# Altium schematic sheet Sheet1.SchDoc
size A
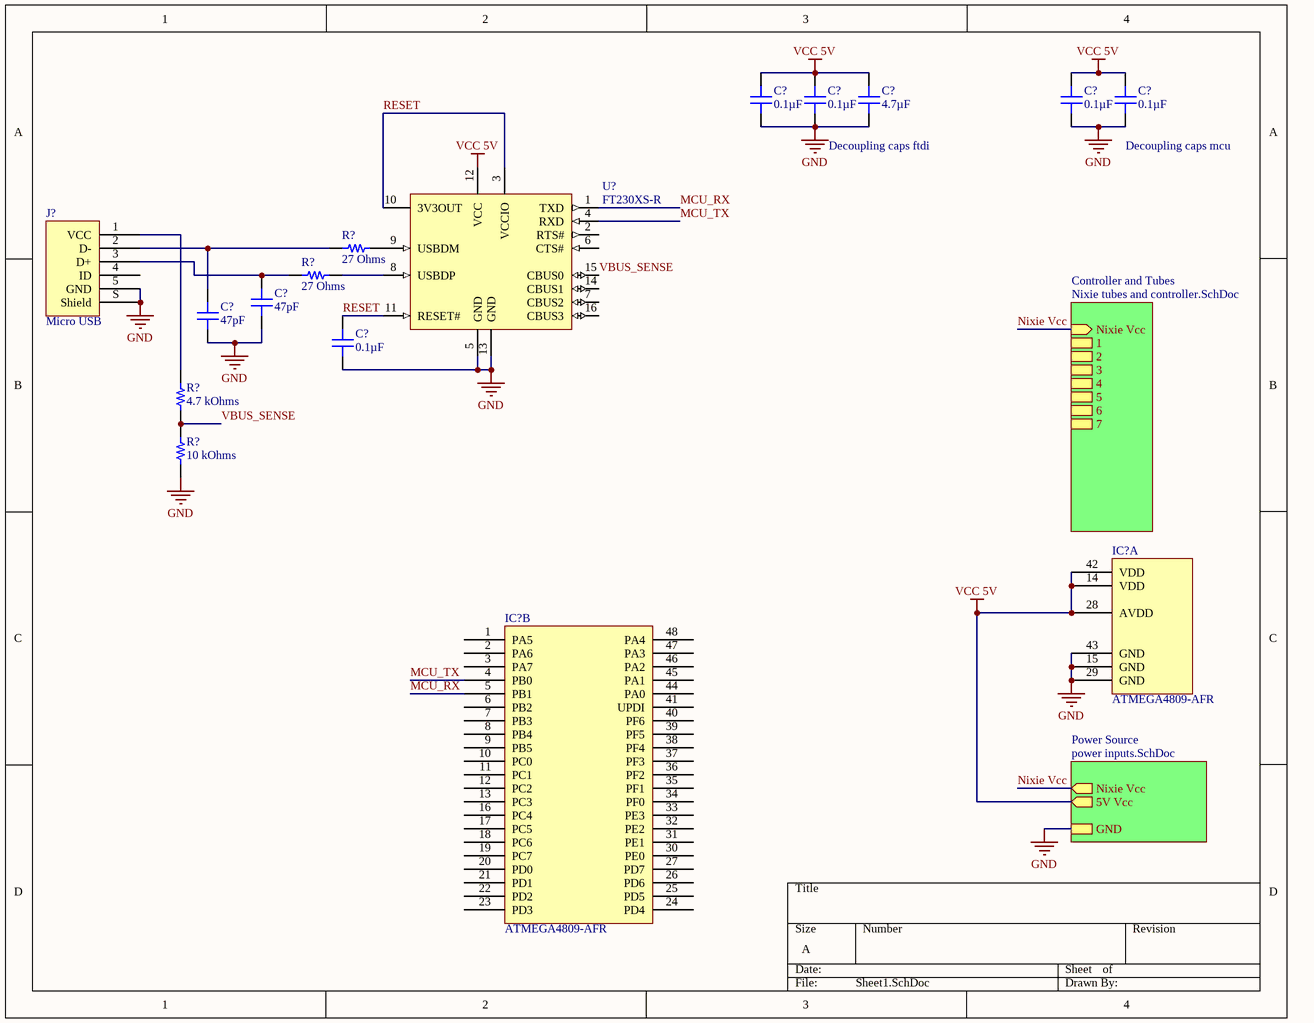
[diagram p0: Sheet1.SchDoc]

## Parts
(Parts that share a designator on the sheet are numbered #1, #2 ... from top to bottom, then left to right.)
C?#1  0.1µF  [CAP 0805_2012]
C?#2  0.1µF  [CAP 0805_2012]
C?#3  4.7µF  [CAP 0805_2012]
C?#4  0.1µF  [CAP 0805_2012]
C?#5  0.1µF  [CAP 0805_2012]
C?#6  47pF  [CAP 0805_2012]
C?#7  47pF  [CAP 0805_2012]
C?#8  0.1µF  [CAP 0805_2012]
IC?#1  ATMEGA4809-AFR  [ATMEGA4809-AFR]  (part A of 2)
IC?#2  ATMEGA4809-AFR  [ATMEGA4809-AFR]  (part B of 2)
J?  Micro USB  [FCI USB 10118193-0001LF]
R?#1  27 Ohms  [RES 0805_2012]
R?#2  27 Ohms  [RES 0805_2012]
R?#3  4.7 kOhms  [RES 0805_2012]
R?#4  10 kOhms  [RES 0805_2012]
U?  FT230XS-R  [SSOP-16_M]

## Sub-sheets
Controller and Tubes = Nixie tubes and controller.SchDoc: Nixie Vcc (in), 1, 2, 3, 4, 5, 6, 7
Power Source = power inputs.SchDoc: 5V Vcc (out), Nixie Vcc (out), GND

## Nets
GND: C?#1.1 C?#2.1 C?#3.1 C?#4.1 C?#5.1 C?#6.1 C?#7.1 C?#8.1 IC?#1.15(GND) IC?#1.29(GND) IC?#1.43(GND) J?.5(GND) J?.S(Shield) R?#4.1 U?.5(GND) U?.13(GND) ; sheet Power Source/GND
VCC 5V: C?#1.2 C?#2.2 C?#3.2 C?#4.2 C?#5.2 IC?#1.14(VDD) IC?#1.28(AVDD) IC?#1.42(VDD) U?.12(VCC) ; sheet Power Source/5V Vcc
MCU_RX: IC?#2.5(PB1) U?.1(TXD)
MCU_TX: IC?#2.4(PB0) U?.4(RXD)
Nixie Vcc: sheet Controller and Tubes/Nixie Vcc, sheet Power Source/Nixie Vcc
RESET: C?#8.2 U?.3(VCCIO) U?.10(3V3OUT) U?.11(RESET#)
VBUS_SENSE: R?#3.1 R?#4.2 U?.15(CBUS0)
NetC?#6_2: C?#6.2 J?.3(D+) R?#2.1
NetC?#7_2: C?#7.2 J?.2(D-) R?#1.1
NetJ?_1: J?.1(VCC) R?#3.2
NetR?#1_2: R?#1.2 U?.9(USBDM)
NetR?#2_2: R?#2.2 U?.8(USBDP)

Not connected (* = marked no-connect by the designer): IC?#2 1(PA5) 2(PA6) 3(PA7) 6(PB2) 7(PB3) 8(PB4) 9(PB5) 10(PC0) 11(PC1) 12(PC2) 13(PC3) 16(PC4) 17(PC5) 18(PC6) 19(PC7) 20(PD0) 21(PD1) 22(PD2) 23(PD3) 24(PD4) 25(PD5) 26(PD6) 27(PD7) 30(PE0) 31(PE1) 32(PE2) 33(PE3) 34(PF0) 35(PF1) 36(PF2) 37(PF3) 38(PF4) 39(PF5) 40(PF6) 41(UPDI) 44(PA0) 45(PA1) 46(PA2) 47(PA3) 48(PA4); J? 4(ID); U? 2(RTS#) 6(CTS#) 7(CBUS2) 14(CBUS1) 16(CBUS3)

## Notes on the sheet
- (near C?#3) Decoupling caps ftdi
- (near C?#5) Decoupling caps mcu

## Library data of the parts
C?#1 C?#2 C?#4 C?#5 C?#8 = 0805ZD104KAT2A: CAP CER 0.1UF 10V X5R 0805; Manufacturer: AVX Corporation; Tolerance: ±10%; Part Number: 0805ZD104KAT2A; Value: 0.1µF; Applications: General Purpose; Capacitance: 0.1µF; ComponentLink1Description: Datasheet; ComponentLink1URL: http://datasheets.avx.com/cx5r.pdf; ComponentLink2Description: DigiKey Link; ComponentLink2URL: http://digikey.com/product-detail/en/avx-corporation/0805ZD104KAT2A/478-12799-1-ND/9949339; Device Package: 0805 (2012 Metric); LastUpdated: 21.01.2020 00:02:37; Lifecycle Status: Active; Minimum Order: 1; Mounting Type: Surface Mount, MLCC; Operating Temperature: -55°C ~ 85°C; Package / Case: 0805 (2012 Metric); Packaging: TapeAndReel; PartId: 18470; Part Status: Active; Price: 0.01; Series: -; Size / Dimension: 0.079" L x 0.049" W (2.01mm x 1.25mm); Supplier 1: DigiKey; Supplier Part Number 1: 478-12799-1-ND; Temperature Coefficient: X5R; Thickness (Max): 0.055" (1.40mm); Voltage - Rated: 10V
C?#3 = C2012X6S1E475M125AC: CAP CER 4.7UF 25V X6S 0805; Manufacturer: TDK Corporation; Tolerance: ±20%; Part Number: C2012X6S1E475M125AC; Value: 4.7µF; Applications: General Purpose; Capacitance: 4.7µF; ComponentLink1Description: Datasheet; ComponentLink1URL: https://product.tdk.com/info/en/catalog/datasheets/mlcc_commercial_general_en.pdf?ref_disty=digikey; ComponentLink2Description: DigiKey Link; ComponentLink2URL: http://digikey.com/product-detail/en/tdk-corporation/C2012X6S1E475M125AC/445-7606-1-ND/2733678; Device Package: 0805 (2012 Metric); Features: Low ESL; LastUpdated: 21.01.2020 00:02:51; Lifecycle Status: Active; Minimum Order: 1; Mounting Type: Surface Mount, MLCC; Operating Temperature: -55°C ~ 105°C; Package / Case: 0805 (2012 Metric); Packaging: TapeAndReel; PartId: 12556; Part Status: Active; Price: 0.14; Series: C; Size / Dimension: 0.079" L x 0.049" W (2.00mm x 1.25mm); Supplier 1: DigiKey; Supplier Part Number 1: 445-7606-1-ND; Temperature Coefficient: X6S; Thickness (Max): 0.057" (1.45mm); Voltage - Rated: 25V
C?#6 C?#7 = C0805C470G5GAC7800: CAP CER 47PF 50V NP0 0805; Manufacturer: KEMET; Temperature Coefficient: C0G, NP0; Tolerance: ±2%; Part Number: C0805C470G5GAC7800; Value: 47pF; Applications: General Purpose; Capacitance: 47pF; ComponentLink1Description: Datasheet; ComponentLink1URL: https://api.kemet.com/component-edge/download/datasheet/C0805C470G5GACTU.pdf; ComponentLink2Description: DigiKey Link; ComponentLink2URL: http://digikey.com/product-detail/en/kemet/C0805C470G5GAC7800/399-14601-1-ND/7103893; Device Package: 0805 (2012 Metric); Features: Low ESL; LastUpdated: 21.01.2020 00:03:00; Lifecycle Status: Active; Minimum Order: 1; Mounting Type: Surface Mount, MLCC; Operating Temperature: -55°C ~ 125°C; Package / Case: 0805 (2012 Metric); Packaging: TapeAndReel; PartId: 6181; Part Status: Active; Price: 0.14; Series: SMD Comm C0G; Size / Dimension: 0.079" L x 0.049" W (2.00mm x 1.25mm); Supplier 1: DigiKey; Supplier Part Number 1: 399-14601-1-ND; Thickness (Max): 0.035" (0.88mm); Voltage - Rated: 50V
IC?#1 IC?#2 = ATMEGA4809-AFR: Manufacturer: Microchip; Manufacturer Part No: ATMEGA4809-AFR; Order Code: *; Component Type: IC; Supplier: *
J? = 10118193-0001LF: CONN USB MICRO B RECPT SMT R/A; Part Number: 10118193-0001LF
R?#1 R?#2 = CRGP0805F27R: CRGP 0805 27R 1%; Manufacturer: TE Connectivity Passive Product; Power (Watts): 0.333W, 1/3W; Temperature Coefficient: ±200ppm/°C; Part Number: CRGP0805F27R; Value: 27 Ohms; ComponentLink1Description: Datasheet; ComponentLink1URL: https://www.te.com/commerce/DocumentDelivery/DDEController?Action=srchrtrv&DocNm=9-1773463-9&DocType=DS&DocLang=English; ComponentLink2Description: DigiKey Link; ComponentLink2URL: http://digikey.com/product-detail/en/te-connectivity-passive-product/CRGP0805F27R/A130458CT-ND/8578290; Composition: Thick Film; Device Package: 0805 (2012 Metric); Features: Pulse Withstanding; Height - Seated (Max): 0.026" (0.65mm); LastUpdated: 21.01.2020 01:49:38; Lifecycle Status: Active; Minimum Order: 1; Number of Terminations: 2; Operating Temperature: -55°C ~ 155°C; Package / Case: 0805 (2012 Metric); Packaging: TapeAndReel; PartId: 28706; Part Status: Active; Price: 0.02; Resistance: 27 Ohms; Series: CRGP; Size / Dimension: 0.079" L x 0.049" W (2.00mm x 1.25mm); Supplier 1: DigiKey; Supplier Part Number 1: A130458CT-ND; Supplier Device Package: 0805; Tolerance: ±1%
R?#3 = RCS08054K70JNEA: RES SMD 4.7K OHM 5% 0.4W 0805; Manufacturer: Vishay Dale; Power (Watts): 0.4W, 2/5W; Temperature Coefficient: ±200ppm/°C; Part Number: RCS08054K70JNEA; Value: 4.7 kOhms; ComponentLink1Description: Datasheet; ComponentLink1URL: http://www.vishay.com/docs/20065/rcse3.pdf; ComponentLink2Description: DigiKey Link; ComponentLink2URL: http://digikey.com/product-detail/en/vishay-dale/RCS08054K70JNEA/541-2866-1-ND/5867159; Composition: Thick Film; Device Package: 0805 (2012 Metric); Features: Automotive AEC-Q200, Pulse Withstanding; Height - Seated (Max): 0.020" (0.50mm); LastUpdated: 21.01.2020 01:50:02; Lifecycle Status: Active; Minimum Order: 1; Number of Terminations: 2; Operating Temperature: -55°C ~ 155°C; Package / Case: 0805 (2012 Metric); Packaging: TapeAndReel; PartId: 27839; Part Status: Active; Price: 0.02; Ratings: AEC-Q200; Resistance: 4.7 kOhms; Series: AccliMate™ RCU; Size / Dimension: 0.079" L x 0.049" W (2.00mm x 1.25mm); Supplier 1: DigiKey; Supplier Part Number 1: 541-2866-1-ND; Supplier Device Package: 0805; Tolerance: ±5%
R?#4 = RNCS0805BKE10K0: RES 10K OHM 0.1% 1/10W 0805; Manufacturer: Stackpole Electronics Inc; Power (Watts): 0.1W, 1/10W; Temperature Coefficient: ±25ppm/°C; Part Number: RNCS0805BKE10K0; Value: 10 kOhms; ComponentLink1Description: Datasheet; ComponentLink1URL: https://www.seielect.com/catalog/sei-rncs_rnch.pdf; ComponentLink2Description: DigiKey Link; ComponentLink2URL: http://digikey.com/product-detail/en/stackpole-electronics-inc/RNCS0805BKE10K0/RNCS0805BKE10K0CT-ND/1800164; Composition: Thin Film; Device Package: 0805 (2012 Metric); Features: Anti-Corrosive, Automotive AEC-Q200, Moisture Resistant; Height - Seated (Max): 0.026" (0.65mm); LastUpdated: 21.01.2020 01:50:08; Lifecycle Status: Active; Minimum Order: 1; Number of Terminations: 2; Operating Temperature: -55°C ~ 155°C; Package / Case: 0805 (2012 Metric); Packaging: TapeAndReel; PartId: 27713; Part Status: Active; Price: 0.09; Ratings: AEC-Q200; Resistance: 10 kOhms; Series: RNCS; Size / Dimension: 0.079" L x 0.049" W (2.00mm x 1.25mm); Supplier 1: DigiKey; Supplier Part Number 1: RNCS0805BKE10K0CT-ND; Supplier Device Package: 0805; Tolerance: ±0.1%
U? = CMP-0248-00026-2: USB to Basic UART Interface Chip, UHCI/OHCI/EHCI Compatible, USB 2.0 Compatible, -40 to +85 degC, 16-Pin SSOP, Pb-Free, Tape and Reel; Manufacturer: FTDI; DatasheetVersion: ver 1.2, Feb-2013; PackageDescription: 16-Pin Small Outline Package, 8.6 x 3.9 mm Body, 0.635 mm Pitch; ComponentLink1Description: Manufacturer URL; ComponentLink2Description: Datasheet; ComponentLink2URL: http://www.ftdichip.com/Support/Documents/DataSheets/ICs/DS_FT230X.pdf; ComponentLink3URL: www.ftdichip.com/Products/ICs/FT230X.html; ComponentLink3Description: FT230X Product Page; PackageReference: SSOP-16; ComponentLink1URL: http://www.ftdichip.com/; PartNumber: FT230XS-R; RevisionNote: DatasheetVersion updated to 1.2 Feb-2013; Code_JEDEC: MO-137-AB; PackageVersion: Feb-13